# Altium schematic sheet Filter.SchDoc
size A4; SheetNumber: 2; SheetTotal: 3
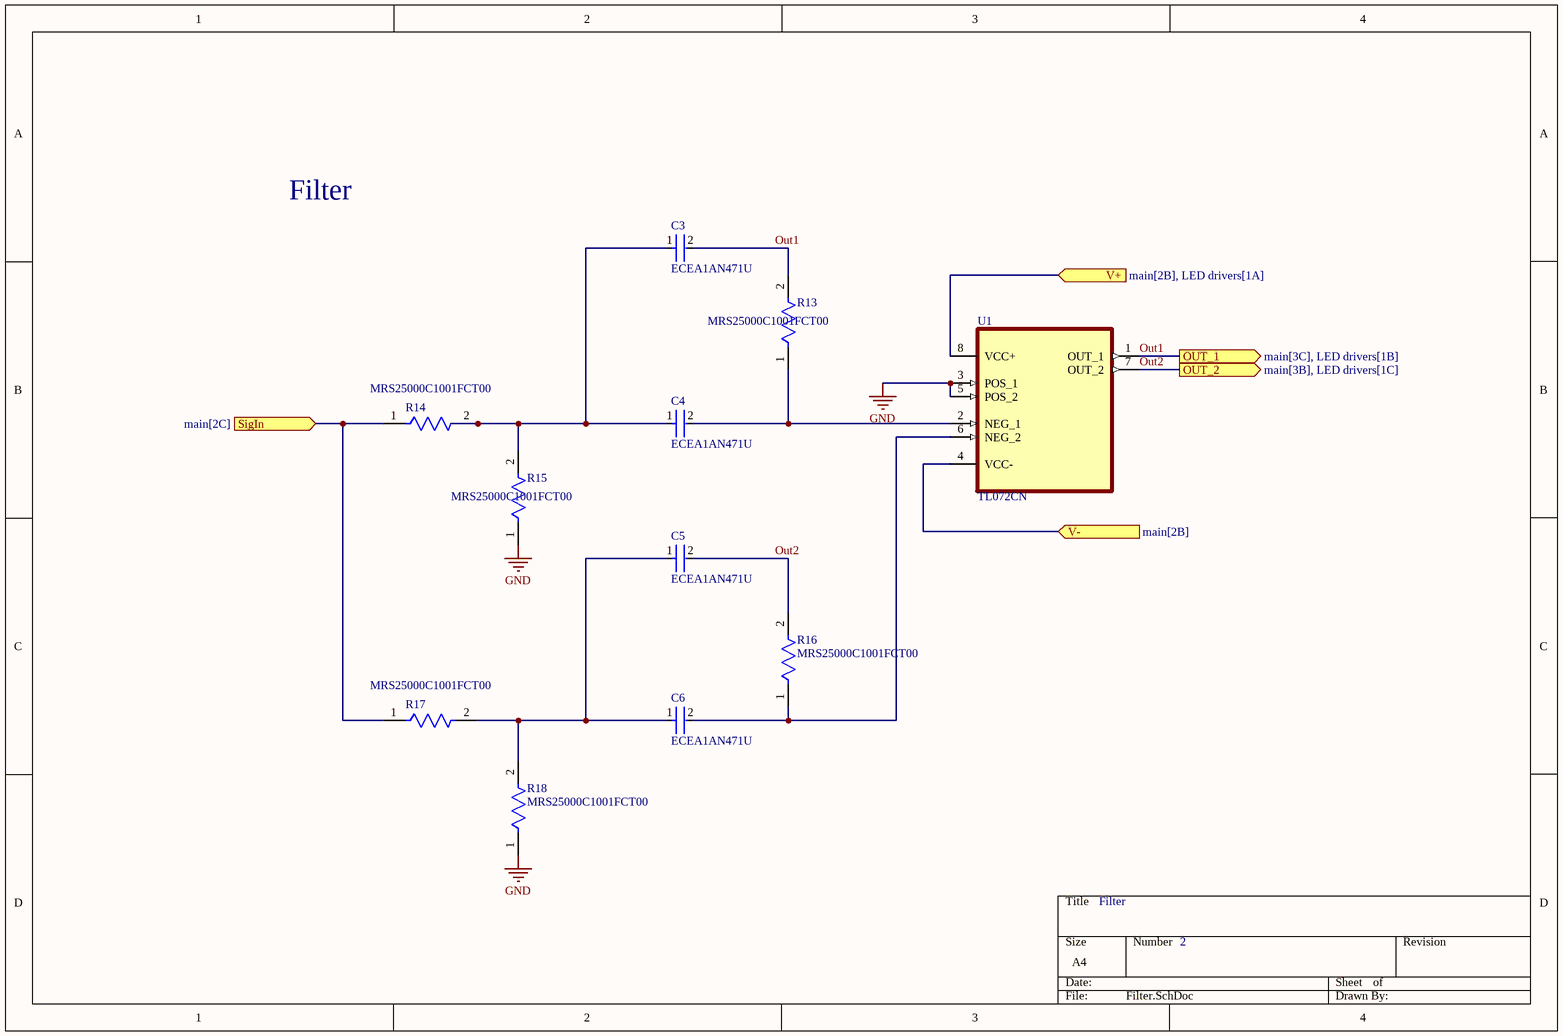
[diagram p0: Filter.SchDoc]

## Parts
C3  ECEA1AN471U  [FP-RAD-TH-D_10_0_5-L_16_1-MFG]
C4  ECEA1AN471U  [FP-RAD-TH-D_10_0_5-L_16_1-MFG]
C5  ECEA1AN471U  [FP-RAD-TH-D_10_0_5-L_16_1-MFG]
C6  ECEA1AN471U  [FP-RAD-TH-D_10_0_5-L_16_1-MFG]
R13  MRS25000C1001FCT00  [FP-MRS25-MFG]
R14  MRS25000C1001FCT00  [FP-MRS25-MFG]
R15  MRS25000C1001FCT00  [FP-MRS25-MFG]
R16  MRS25000C1001FCT00  [FP-MRS25-MFG]
R17  MRS25000C1001FCT00  [FP-MRS25-MFG]
R18  MRS25000C1001FCT00  [FP-MRS25-MFG]
U1  TL072CN  [DIP254P762X533-8]

## Ports
OUT_1 (out, see main[3C], LED drivers[1B]), OUT_2 (out, see main[3B], LED drivers[1C]), SigIn (in, see main[2C]), V+ (in, see main[2B], LED drivers[1A]), V- (in, see main[2B])

## Nets
GND: R15.1 R18.1 U1.3(POS_1) U1.5(POS_2)
Out1: C3.2 R13.2 U1.1(OUT_1) ; port OUT_1
Out2: C5.2 R16.2 U1.7(OUT_2) ; port OUT_2
SigIn: R14.1 R17.1 ; port SigIn
V+: U1.8(VCC+) ; port V+
V-: U1.4(VCC-) ; port V-
NetC3_1: C3.1 C4.1 R14.2 R15.2
NetC4_2: C4.2 R13.1 U1.2(NEG_1)
NetC5_1: C5.1 C6.1 R17.2 R18.2
NetC6_2: C6.2 R16.1 U1.6(NEG_2)

## Notes on the sheet
- Filter
- 2

## Library data of the parts
C3-C6 = CMP-05427-001928-1: Aluminum Electrolytic Capacitors (Radial Lead Type) 470uF ±20% 10V; Lead Diameter: 0.6mm; Dissipation Factor: 0.25%; Life (Hours): 2000Hour; Leakage Current: 3uA; Ripple Current: 340mA; Mount: Through Hole; REACH SVHC: No SVHC; Height: 16mm; Max Operating Temperature: 85°C; Case/Package: Radial; Packaging: Bulk; RoHS Compliant: Yes; Min Operating Temperature: -40°C; Termination: Radial; Height - Seated (Max): 0.63inch; Series: SU; Construction: RADIAL; Capacitance: 470uF; Tolerance: 20%; Radiation Hardening: No; Voltage Rating (DC): 10V; Lead Free: Lead Free; Diameter: 10mm; Lead Pitch: 5mm; Voltage Rating: 10V; Length: 16mm; Voltage: 10V; Package Quantity: 200
R13-R18 = CMP-02408-000051-1: RES 1K OHM 0.6W 1% AXIAL; Power Rating: 600mW; Lead Diameter: 0.6mm; Voltage Rating (DC): 350V; Resistance: 1kR; Temperature Coefficient: 50ppm/°C; Width: 2.5mm; Military Standard: Not; Package Quantity: 5000; Radiation Hardening: No; Case/Package: Axial; Resistance Tolerance: 1%; Resistor Type: Metal Film; Contact Plating: Tin; Length: 6.5mm; Lead Free: Lead Free; RoHS Compliant: Yes; Mount: Through Hole; Number of Pins: 2; Technology: THIN FILM; Voltage Rating: 350V; Min Operating Temperature: -55°C; Weight: 0.00776oz; Diameter: 2.5mm; Construction: Cylindrical; Series: MRS25; Tolerance: 1%; Packaging: Tape and Reel; Max Operating Temperature: 155°C; Max Power Dissipation: 600mW; Number of Terminations: 2; Termination: Axial
U1 = TL072CN: J-FET Amplifier 2 Circuit 8-DIP; MF: Texas Instruments; Price: None; Package: DIP-8 Texas Instruments; MP: TL072CN; Value: *; Availability: Unavailable; SnapEDA_Link: https://www.snapeda.com/parts/TL072CN/Texas%20Instruments/view-part/576842/?ref=snap